# Altium schematic sheet DIGITAL_DATA.SchDoc
size B; SheetNumber: 2; SheetTotal: 3
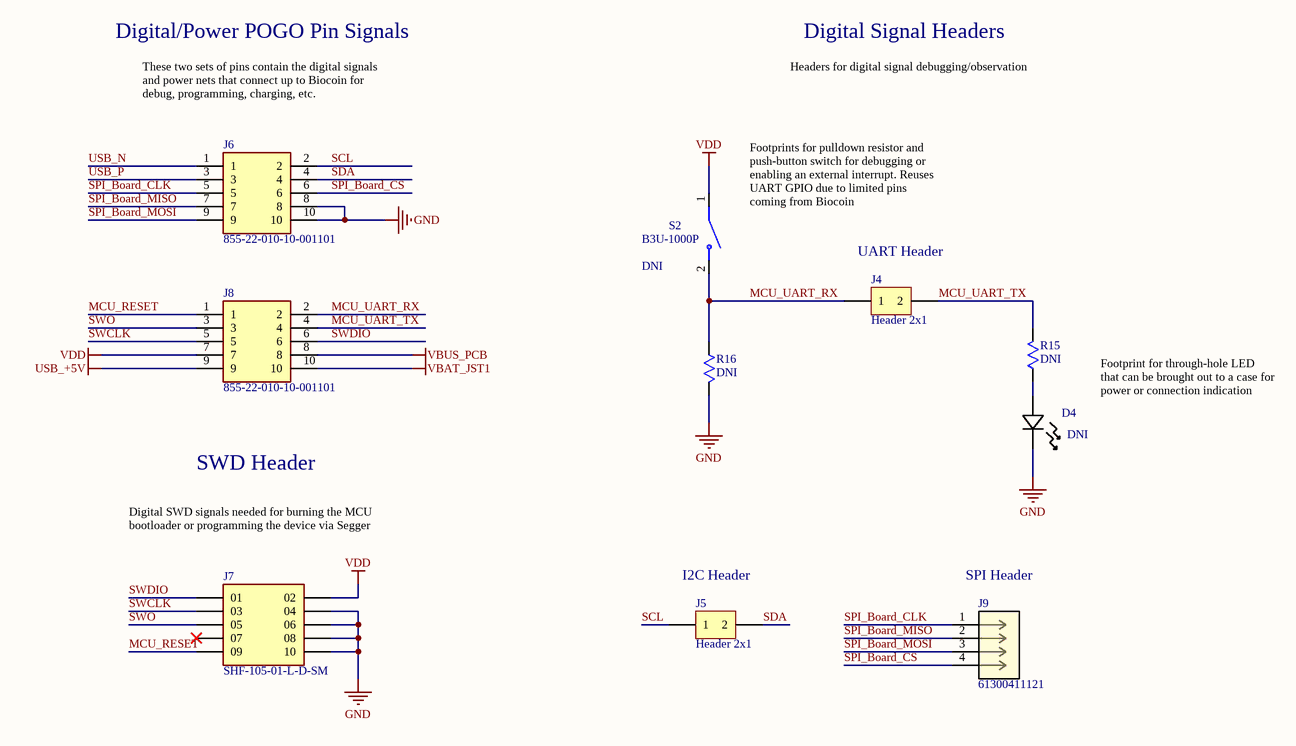
[diagram p0: DIGITAL_DATA.SchDoc]

## Parts
D4  Do Not Install: DNI  [LED_SLI-343D_ROM]  (hidden comment: SLI-343V8RC3F)
J4  Header 2x1  [Header 1x2]
J5  Header 2x1  [Header 1x2]
J6  855-22-010-10-001101  [HDRV10W41P127_2X5_927X300X627P]
J7  SHF-105-01-L-D-SM  [SAMTEC_SHF-105-01-L-D-SM]
J8  855-22-010-10-001101  [HDRV10W41P127_2X5_927X300X627P]
J9  61300411121  [CONN_61300411121_WRE]
R15  value DNI  [0805-RES]  (hidden comment: RES)
R16  value DNI  [0805-RES]  (hidden comment: RES)
S2  B3U-1000P  Do Not Install: DNI  [SW_B3U-1000P]

## Nets
GND: D4.1 J6.8 J6.10 J7.04 J7.06 J7.08 J7.10 R16.2
USB_+5V: J8.9
VBAT_JST1: J8.10
VBUS_PCB: J8.8
VDD: J7.02 J8.7 S2.1
MCU_RESET: J7.09 J8.1
MCU_UART_RX: J4.1 J8.2 R16.1 S2.2
MCU_UART_TX: J4.2 J8.4 R15.2
SCL: J5.1 J6.2
SDA: J5.2 J6.4
SPI_Board_CLK: J6.5 J9.1
SPI_Board_CS: J6.6 J9.4
SPI_Board_MISO: J6.7 J9.2
SPI_Board_MOSI: J6.9 J9.3
SWCLK: J7.03 J8.5
SWDIO: J7.01 J8.6
SWO: J7.05 J8.3
USB_N: J6.1
USB_P: J6.3
NetD4_2: D4.2 R15.1

Not connected (* = marked no-connect by the designer): J7 07*

## Notes on the sheet
- Digital/Power POGO Pin Signals
- Digital Signal Headers
- These two sets of pins contain the digital signals and power nets that connect up to Biocoin for debug, programming, charging, etc.
- Headers for digital signal debugging/observation
- (near S2) Footprints for pulldown resistor and push-button switch for debugging or enabling an external interrupt. Reuses UART GPIO due to limited pins coming from Biocoin
- (near J4) UART Header
- Footprint for through-hole LED that can be brought out to a case for power or connection indication
- SWD Header
- Digital SWD signals needed for burning the MCU bootloader or programming the device via Segger
- (near J5) I2C Header
- (near J9) SPI Header

## Library data of the parts
D4 = SLI-343V8RC3F: No Description Available; Vendor: ROHM Semiconductor; Built_By: EMA_Matt; SourceLibrary: Rohm_2019-09-23; Manufacturer_Part_Number: SLI-343V8RC3F; Copyright: Copyright (C) 2018 Accelerated Designs. All rights reserved; Parameter 2: *
J4 J5 = Header 2x1: Pin Header 2x1; Designer: OMIGA
J6 J8 = 10 pin Pogo Pin Male Header: Manufacturer_Name: Mill-Max; Datasheet Link: https://www.mill-max.com/products/socket/855-XX-XXX-10-001101/855-22-010-10-001101; Height: 6.274mm; Manufacturer_Part_Number: 855-22-010-10-001101
J7 = SHF-105-01-L-D-SM: SHF - Samtec Wire-to-Board 1.27mm Surface Mount Shrouded Header; Value: *; Package: None; SnapEDA_Link: https://www.snapeda.com/parts/SHF-105-01-L-D-SM/Samtec+Inc./view-part/?ref=snap; MF: Samtec; Check_prices: https://www.snapeda.com/parts/SHF-105-01-L-D-SM/Samtec+Inc./view-part/?ref=eda; Digi-Key_Part_Number: SAM10710-ND; MP: SHF-105-01-L-D-SM; Purchase-URL: https://pricing.snapeda.com/search/part/SHF-105-01-L-D-SM/?ref=eda
J9 = Header 4x1: CONN HEADER VERT 4POS 2.54MM
R15 R16 = RES SMD: Surface Mount Resistor; Designer: OMIGA
S2 = Pushbutton Small: SWITCH TACTILE SPST-NO 0.05A 12V